# EAGLE schematic raspiledmeter (EAGLE 6.2)
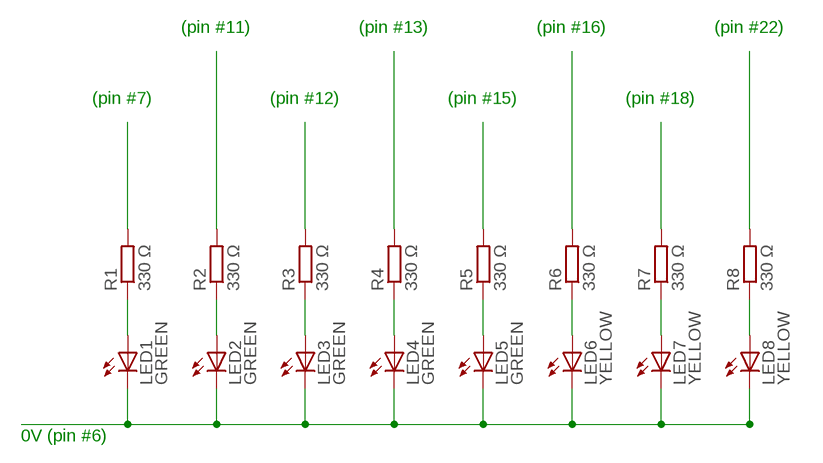
[diagram p0: schematic, sheet 1]

## Parts
LED1  GREEN  LG_T679-E1F1-1  [PLCC2]
LED2  GREEN  LG_T679-E1F1-1  [PLCC2]
LED3  GREEN  LG_T679-E1F1-1  [PLCC2]
LED4  GREEN  LG_T679-E1F1-1  [PLCC2]
LED5  GREEN  LG_T679-E1F1-1  [PLCC2]
LED6  YELLOW  LG_T679-E1F1-1  [PLCC2]
LED7  YELLOW  LG_T679-E1F1-1  [PLCC2]
LED8  YELLOW  LG_T679-E1F1-1  [PLCC2]
R1  330 Ω  R-EU_0204/2V  [0204V]
R2  330 Ω  R-EU_0204/2V  [0204V]
R3  330 Ω  R-EU_0204/2V  [0204V]
R4  330 Ω  R-EU_0204/2V  [0204V]
R5  330 Ω  R-EU_0204/2V  [0204V]
R6  330 Ω  R-EU_0204/2V  [0204V]
R7  330 Ω  R-EU_0204/2V  [0204V]
R8  330 Ω  R-EU_0204/2V  [0204V]

## Nets
N$1: LED1.A R1.1
N$2: LED2.A R2.1
N$3: LED3.A R3.1
N$4: LED4.A R4.1
N$5: LED5.A R5.1
N$6: LED6.A R6.1
N$7: LED7.A R7.1
N$8: LED8.A R8.1
N$9: LED1.C LED2.C LED3.C LED4.C LED5.C LED6.C LED7.C LED8.C
N$10: R1.2
N$11: R2.2
N$12: R3.2
N$13: R4.2
N$14: R5.2
N$15: R6.2
N$16: R7.2
N$17: R8.2

## Notes on the sheet
- (pin #11) | (pin #13) | (pin #16) | (pin #22)
- (pin #7) | (pin #12) | (pin #15) | (pin #18)
- 0V (pin #6)

## Library data of the parts
LED1-LED8 = led:*_T679-?-1: LC TOPLED® Low Current LED Source: http://catalog.osram-os.com .. LG_LS_LY_T679_OBS.pdf; COLOR: green
R1-R8 = rcl:R-EU_: RESISTOR, European symbol